# Altium project TIDA_00620.PrjPcb (part 8 of 8)

## Sheet Sensörler.SchDoc
size A4; SheetNumber: 5; SheetTotal: 5
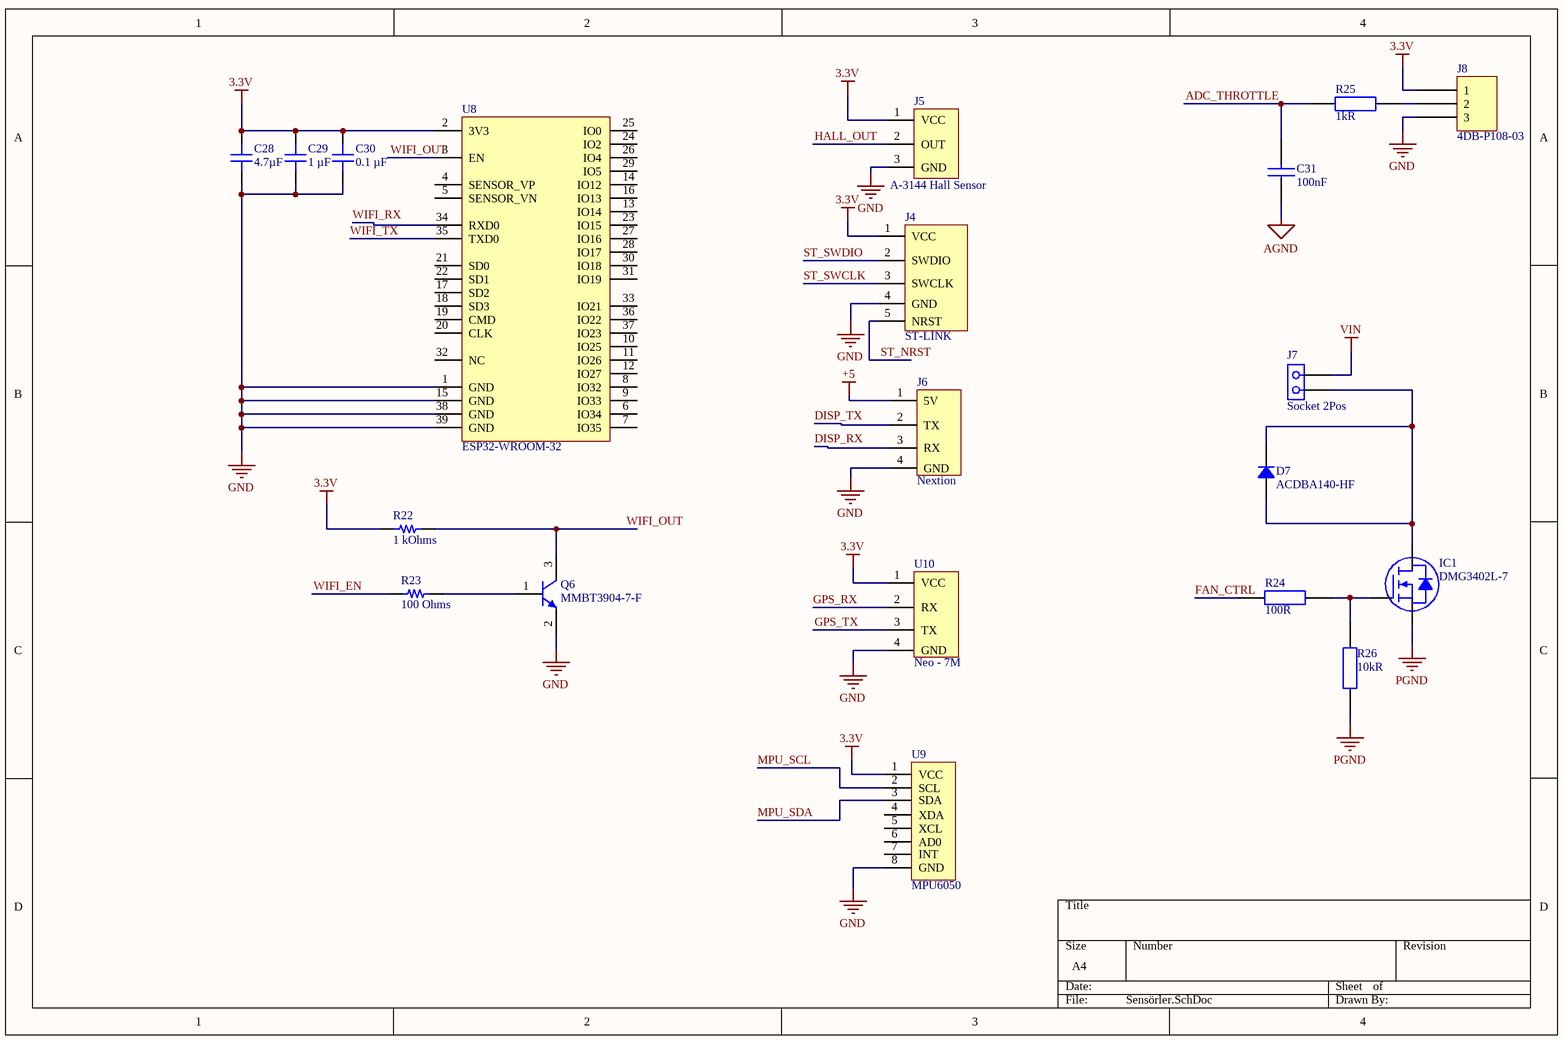
[diagram p4: Sensörler.SchDoc]

### Parts
C28  4.7µF  [CAP 0805_2012]
C29  1 µF  [CAP 0805_2012]
C30  0.1 µF  [CAP 0805_2012]
C31  Capacitance: 100nF  [CAP_0805]  (hidden comment: CL21B104KBCNNNC)
D7  ACDBA140-HF  [DO214AC SMA]
IC1  DMG3402L-7  [DIODES SOT-23-3]
J4  ST-LİNK  [ST-LİNK]
J5  A-3144 Hall Sensor  [A-3144]
J6  Nextion  [Nextion]
J7  Socket 2Pos  [691101710002]
J8  4DB-P108-03  [TE 4DB-P108-03]
Q6  MMBT3904-7-F  [DIODES SOT-23-3]
R22  1 kOhms  [RES 0603_1608]
R23  100 Ohms  [RES 0402_1005]
R24  Resistance: 100R  [RES_0603]  (hidden comment: RC0603JR-07100RL)
R25  Resistance: 1kR  [RES_0603]  (hidden comment: RC0603FR-0710KL)
R26  Resistance: 10kR  [RES_0603]  (hidden comment: RC0603FR-0710KL)
U8  ESP32-WROOM-32  [ESP32-32]
U9  MPU6050  [MPU6050]
U10  Neo - 7M  [Neo - 7M]

### Nets
3.3V: C28.2 C29.2 C30.2 J4.1(VCC) J5.1(VCC) J8.1 R22.1 U8.2(3V3) U9.1(VCC) U10.1(VCC)
+5: J6.1(5V)
AGND: C31.1
GND: C28.1 C29.1 C30.1 J4.4(GND) J5.3(GND) J6.4(GND) J8.3 Q6.2(E) U8.1(GND) U8.15(GND) U8.38(GND) U8.39(GND) U9.8(GND) U10.4(GND)
PGND: IC1.2(S) R26.1
VIN: J7.2
ADC_THROTTLE: C31.2 R25.1
DISP_RX: J6.3(RX)
DISP_TX: J6.2(TX)
FAN_CTRL: R24.1
GPS_RX: U10.2(RX)
GPS_TX: U10.3(TX)
HALL_OUT: J5.2(OUT)
MPU_SCL: U9.2(SCL)
MPU_SDA: U9.3(SDA)
ST_NRST: J4.5(NRST)  [project net NRST]
ST_SWCLK: J4.3(SWCLK)
ST_SWDIO: J4.2(SWDIO)
WIFI_EN: R23.1
WIFI_OUT: Q6.3(C) R22.2 U8.3(EN)
WIFI_RX: U8.34(RXD0)
WIFI_TX: U8.35(TXD0)
NetD7_1: D7.1 D7.2 IC1.3(D) J7.1
NetIC1_1: IC1.1(G) R24.2 R26.2
NetJ8_2: J8.2 R25.2
NetQ6_1: Q6.1(B) R23.2

Not connected (* = marked no-connect by the designer): U8 4(SENSOR_VP) 5(SENSOR_VN) 6(IO34) 7(IO35) 8(IO32) 9(IO33) 10(IO25) 11(IO26) 12(IO27) 13(IO14) 14(IO12) 16(IO13) 17(SD2) 18(SD3) 19(CMD) 20(CLK) 21(SD0) 22(SD1) 23(IO15) 24(IO2) 25(IO0) 26(IO4) 27(IO16) 28(IO17) 29(IO5) 30(IO18) 31(IO19) 32(NC) 33(IO21) 36(IO22) 37(IO23); U9 4(XDA) 5(XCL) 6(AD0) 7(INT)

### Library data of the parts
C28 = 0805YD475MAT2A: CAP CER 4.7UF 16V X5R 0805; manufacturer: AVX Corporation; Tolerance: ±20%; Part Number: 0805YD475MAT2A; Capacitance: 4.7µF; Applications: General Purpose; componentlink1description: Datasheet; componentlink1url: http://datasheets.avx.com/cx5r.pdf; componentlink2description: DigiKey Link; componentlink2url: http://digikey.com/product-detail/en/avx-corporation/0805YD475MAT2A/478-6223-1-ND/2391422; Device Package: 0805 (2012 Metric); lastupdated: 2.09.2020 01:04:29; Lifecycle Status: Active; Minimum Order: 1; Mounting Type: Surface Mount, MLCC; Operating Temperature: -55°C ~ 85°C; Package / Case: 0805 (2012 Metric); packaging: TapeAndReel; partid: 9663; Part Status: Active; price: 0.19; series: -; Size / Dimension: 0.079" L x 0.049" W (2.01mm x 1.25mm); Supplier 1: DigiKey; Supplier Part Number 1: 478-6223-1-ND; Temperature Coefficient: X5R; Thickness (Max): 0.055" (1.40mm); value: 4.7µF; Voltage - Rated: 16V
C29 = EMK212B7105KGHTR: CAP CER 1UF 16V X7R 0805; manufacturer: Taiyo Yuden; Tolerance: ±10%; Part Number: EMK212B7105KGHTR; Capacitance: 1 µF; Applications: Automotive; componentlink1description: Datasheet; componentlink1url: https://ds.yuden.co.jp/TYCOMPAS/ut/detail?pn=EMK212B7105KGHTR &u=M; componentlink2description: DigiKey Link; componentlink2url: https://www.digikey.com/en/products/detail/taiyo-yuden/EMK212B7105KGHTR/6563155; Device Package: 0805 (2012 Metric); lastupdated: 9.02.2024 20:16:06; Lifecycle Status: Active; Minimum Order: 1; Mounting Type: Surface Mount, MLCC; Operating Temperature: -55°C ~ 125°C; Package / Case: 0805 (2012 Metric); packaging: TapeAndReel; partid: 3641; Part Status: Active; price: 0.03; Ratings: AEC-Q200; series: M; Size / Dimension: 0.079" L x 0.049" W (2.00mm x 1.25mm); Supplier 1: DigiKey; Supplier Part Number 1: 587-6310-1-ND; Temperature Coefficient: X7R; Thickness (Max): 0.053" (1.35mm); value: 1 µF; Voltage - Rated: 16V
C30 = 0805B104K160CT: CAP CER 0.1UF 16V X7R 0805; manufacturer: Walsin Technology Corporation; Tolerance: ±10%; Part Number: 0805B104K160CT; Capacitance: 0.1 µF; Applications: General Purpose; componentlink1description: Datasheet; componentlink1url: http://www.passivecomponent.com/wp-content/uploads/2018/10/MLCC.pdf; componentlink2description: DigiKey Link; componentlink2url: https://www.digikey.com/en/products/detail/walsin-technology-corporation/0805B104K160CT/9355062; Device Package: 0805 (2012 Metric); lastupdated: 9.02.2024 20:16:02; Lifecycle Status: Active; Minimum Order: 1; Mounting Type: Surface Mount, MLCC; Operating Temperature: -55°C ~ 125°C; Package / Case: 0805 (2012 Metric); packaging: TapeAndReel; partid: 4882; Part Status: Active; price: 0.01; series: -; Size / Dimension: 0.079" L x 0.049" W (2.00mm x 1.25mm); Supplier 1: DigiKey; Supplier Part Number 1: 1292-1565-1-ND; Temperature Coefficient: X7R; Thickness (Max): 0.035" (0.90mm); value: 0.1 µF; Voltage - Rated: 16V
C31 = CAP CER 100nF 0805: CAP CER 100nF %10 0805; Manufacturer: Samsung; Designed by: BERK; Material: Ceramic; Tolerance: 10%; Dielectric: X7R; Voltage Rating: 50V; Supplier 1: Digi-Key; Manufacturer Part Number: CL21B104KBCNNNC; RoHS: Yes; Category: Ceramic Capacitors; Stock 1: 3371502; Pricing 1: 1=0,10000, 10=0,04700, 50=0,02560, 100=0,02090, 500=0,01494, 1000=0,01174 (USD); Mount: Surface Mount; Case/Package: 0805; Case Code (Metric): 2012; Case Code (Imperial): 0805; Contact Plating: Tin; Min Operating Temperature: -55°C; Max Operating Temperature: 125°C; Packaging: Tape and Reel; Voltage: 50V; Voltage Rating (DC): 50V; Series: CL; Construction: Flat; Length: 2mm; Width: 0.049inch; Height: 0.85mm; Depth: 1.25mm; Thickness: 0.037inch; Radiation Hardening: No; Lead Free: Lead Free; RoHS Compliant: Yes; ComponentLink1URL: https://datasheet.ciiva.com/25710/cl21b104kbcnnnc-25710182.pdf?src-supplier=Digi-Key; ComponentLink1Description: https://datasheet.ciiva.com/25710/cl21b104kbcnnnc-25710182.pdf?src-supplier=Digi-Key; ComponentLink2URL: https://datasheet.ciiva.com/29199/454152-da-01-en-vs-kondensator-0805-29199814.pdf?src-supplier=Conrad; ComponentLink2Description: https://datasheet.ciiva.com/29199/454152-da-01-en-vs-kondensator-0805-29199814.pdf?src-supplier=Conrad; Supplier Part Number 1: 1276-1003-1-ND
D7 = ACDBA140-HF: DIODE SCHOTTKY 40V 1A DO214AC; Manufacturer: Comchip Technology; Capacitance @ Vr, F: 65pF @ 4V, 1MHz; Current - Reverse Leakage @ Vr: 500 µA @ 40 V; Speed: Fast Recovery =< 500ns, > 200mA (Io); Voltage - Forward (Vf) (Max) @ If: 500 mV @ 1 A; Part Number: ACDBA140-HF; ComponentLink1Description: Datasheet; ComponentLink1URL: http://www.comchiptech.com/admin/files/product/ACDBA140-HF%20RevA666308.pdf; ComponentLink2Description: DigiKey Link; ComponentLink2URL: https://www.digikey.com/en/products/detail/comchip-technology/ACDBA140-HF/7100722; Current - Average Rectified (Io): 1A; Diode Type: Schottky; LastUpdated: 3.06.2024 19:54:32; Lifecycle Status: Active; Minimum Order: 1; Mounting Type: Surface Mount; Operating Temperature - Junction: -55°C ~ 125°C; Package / Case: DO-214AC, SMA; Packaging: TapeAndReel; PartId: 2046; Part Status: Active; Price: 0.07; Series: Automotive, AEC-Q101; Supplier 1: DigiKey; Supplier Part Number 1: 641-1872-1-ND; Supplier Device Package: DO-214AC (SMA); Voltage - DC Reverse (Vr) (Max): 40 V
IC1 = DMG3402L-7: MOSFET N-CH 30V 4A SOT23; Manufacturer: Diodes Incorporated; Current - Continuous Drain (Id) @ 25°C: 4A (Ta); Drive Voltage (Max Rds On,  Min Rds On): 2.5V, 10V; FET Type: N-Channel; Gate Charge (Qg) (Max) @ Vgs: 11.7 nC @ 10 V; Input Capacitance (Ciss) (Max) @ Vds: 464 pF @ 15 V; Power Dissipation (Max): 1.4W (Ta); Rds On (Max) @ Id, Vgs: 52mOhm @ 4A, 10V; Vgs (Max): ±12V; Vgs(th) (Max) @ Id: 1.4V @ 250µA; Part Number: DMG3402L-7; ComponentLink1Description: Datasheet; ComponentLink1URL: https://www.diodes.com/assets/Datasheets/DMG3402L.pdf; ComponentLink2Description: DigiKey Link; ComponentLink2URL: https://www.digikey.com/en/products/detail/diodes-incorporated/DMG3402L-7/4747630; Drain to Source Voltage (Vdss): 30 V; LastUpdated: 3.06.2024 20:15:16; Lifecycle Status: Active; Minimum Order: 1; Mounting Type: Surface Mount; Operating Temperature: -55°C ~ 150°C (TJ); Package / Case: TO-236-3, SC-59, SOT-23-3; Packaging: TapeAndReel; Part Status: Active; Price: 0.05; Series: -; Supplier 1: DigiKey; Supplier Part Number 1: DMG3402L-7DICT-ND; Supplier Device Package: SOT-23-3; Technology: MOSFET (Metal Oxide)
J7 = 691 101 710 002: Conn Terminal Block 2 POS 5mm Solder ST Thru-Hole 16A Box; Manufacturer: Wurth Elektronik; Number of Contacts: 2; Number of Levels: 1; Plating: Steel; Stripping Length: -7mm; Voltage: 250V; Wire/Cable Gauge: 26AWG; Wire Gauge (Min): 14AWG; Supplier: Mouser; Supplier Part Number: 710-691101710002; Manufacturer Part Number: 691101710002; RoHS: Compliant; Category: Terminal Blocks; Stock: 2054; Pricing: 1=0,73, 10=0,657, 50=0,653, 100=0,653, 1000=0,653, 10000=0,653 (USD); Color: Blue; Contact Material: Brass; Contact Plating: Tin; Current: 16A; Current Rating: 16A; Height: 12.6mm; Housing Material: Nylon; Lead Pitch: 5mm; Length: 10mm; Max Operating Temperature: 105°C; Min Operating Temperature: -40°C; Mounting Technology: Through Hole; Pins: 2; Number of Positions Per Level: 2; Number of Rows: 1; Packaging: Box; Pitch: 5mm; Termination: Screw; Voltage Rating: 250V; Width: 11.2mm; Wire Gauge (Max): 26AWG; ComponentLink1URL: https://datasheet.octopart.com:443/691101710002-W%C3%BCrth-Elektronik-datasheet-117282612.pdf?src-supplier=Farnell; ComponentLink1Description: https://datasheet.octopart.com:443/691101710002-W%C3%BCrth-Elektronik-datasheet-117282612.pdf?src-supplier=Farnell; ComponentLink2URL: https://datasheet.octopart.com:443/691101710002-W%C3%BCrth-Elektronik-Midcom-datasheet-10621893.pdf?src-supplier=Farnell; ComponentLink2Description: https://datasheet.octopart.com:443/691101710002-W%C3%BCrth-Elektronik-Midcom-datasheet-10621893.pdf?src-supplier=Farnell; ComponentLink3URL: https://datasheet.octopart.com:443/691101710002-Wurth-Elektronik-datasheet-181965939.pdf?src-supplier=Wurth+Elektronik; ComponentLink3Description: https://datasheet.octopart.com:443/691101710002-Wurth-Elektronik-datasheet-181965939.pdf?src-supplier=Wurth+Elektronik; ComponentLink4URL: https://datasheet.octopart.com:443/691101710002-W%C3%BCrth-Elektronik-Midcom-datasheet-10468440.pdf?src-supplier=Newark; ComponentLink4Description: https://datasheet.octopart.com:443/691101710002-W%C3%BCrth-Elektronik-Midcom-datasheet-10468440.pdf?src-supplier=Newark; ComponentLink5URL: https://datasheet.octopart.com:443/691101710002-W%C3%BCrth-Elektronik-Midcom-datasheet-5404435.pdf?src-supplier=element14+APAC; ComponentLink5Description: https://datasheet.octopart.com:443/691101710002-W%C3%BCrth-Elektronik-Midcom-datasheet-5404435.pdf?src-supplier=element14+APAC; ComponentLink6URL: https://datasheet.octopart.com:443/691101710002-W%C3%BCrth-Elektronik-datasheet-111088173.pdf?src-supplier=RS+(Formerly+Allied+Electronics); ComponentLink6Description: https://datasheet.octopart.com:443/691101710002-W%C3%BCrth-Elektronik-datasheet-111088173.pdf?src-supplier=RS+(Formerly+Allied+Electronics)
J8 = 4DB-P108-03: CONN BARRIER STRIP 3CIRC 0.325"; Manufacturer: TE Connectivity AMP Connectors; Barrier Type: 2 Wall (Dual); Bottom Termination: PC Pin; Current Rating (Amps): 20A; Number of Circuits: 3; Pitch: 0.325" (8.26mm); Top Termination: Screws with Captive Plate; Voltage Rating: 150V; Wire Gauge: 12-22 AWG; Part Number: 4DB-P108-03; Color: Black; ComponentLink1Description: Datasheet; ComponentLink1URL: https://www.te.com/commerce/DocumentDelivery/DDEController?Action=srchrtrv&DocNm=2-1437667-4&DocType=Customer+Drawing&DocLang=English; ComponentLink2Description: DigiKey Link; ComponentLink2URL: http://digikey.com/product-detail/en/te-connectivity-amp-connectors/4DB-P108-03/A98473-ND/1277424; LastUpdated: 15.01.2020 04:13:53; Lifecycle Status: Active; Minimum Order: 1; Number of Rows: 1; Number of Wire Entries: 3; Packaging: Bulk; Part Status: Active; Price: 1.18; Series: 4DB, Buchanan; Supplier 1: DigiKey; Supplier Part Number 1: A98473-ND; Terminal Block Type: Barrier Block
Q6 = MMBT3904-7-F: TRANS NPN 40V 0.2A SOT23-3; Manufacturer: Diodes Incorporated; Current - Collector Cutoff (Max): 50nA (ICBO); Current - Collector (Ic) (Max): 200 mA; DC Current Gain (hFE) (Min) @ Ic, Vce: 100 @ 10mA, 1V; Frequency - Transition: 300MHz; Power - Max: 300 mW; Vce Saturation (Max) @ Ib, Ic: 300mV @ 5mA, 50mA; Part Number: MMBT3904-7-F; ComponentLink1Description: Datasheet; ComponentLink1URL: https://www.diodes.com/assets/Datasheets/ds30036.pdf; ComponentLink2Description: DigiKey Link; ComponentLink2URL: https://www.digikey.com/en/products/detail/diodes-incorporated/MMBT3904-7-F/814494; LastUpdated: 3.06.2024 20:24:11; Lifecycle Status: Active; Minimum Order: 1; Mounting Type: Surface Mount; Operating Temperature: -55°C ~ 150°C (TJ); Package / Case: TO-236-3, SC-59, SOT-23-3; Packaging: TapeAndReel; PartId: 85; Part Status: Active; Price: 0.01; Series: -; Supplier 1: DigiKey; Supplier Part Number 1: MMBT3904-FDICT-ND; Supplier Device Package: SOT-23-3; Transistor Type: NPN; Voltage - Collector Emitter Breakdown (Max): 40 V
R22 = CPF0603B1K0E: RES SMD 1K OHM 0.1% 1/16W 0603; Manufacturer: TE Connectivity Passive Product; Power (Watts): 0.063W, 1/16W; Temperature Coefficient: ±25ppm/°C; Part Number: CPF0603B1K0E; Value: 1 kOhms; ComponentLink1Description: Datasheet; ComponentLink1URL: https://www.te.com/commerce/DocumentDelivery/DDEController?Action=srchrtrv&DocNm=1773200&DocType=DS&DocLang=English; ComponentLink2Description: DigiKey Link; ComponentLink2URL: https://www.digikey.com/en/products/detail/te-connectivity-passive-product/CPF0603B1K0E/2390473; Composition: Thin Film; Device Package: 0603 (1608 Metric); Height - Seated (Max): 0.022" (0.55mm); LastUpdated: 9.02.2024 20:43:37; Lifecycle Status: Active; Minimum Order: 1; Number of Terminations: 2; Operating Temperature: -55°C ~ 155°C; Package / Case: 0603 (1608 Metric); Packaging: TapeAndReel; PartId: 4877; Part Status: Active; Price: 0.09; Resistance: 1 kOhms; Series: CPF, Neohm; Size / Dimension: 0.061" L x 0.031" W (1.55mm x 0.80mm); Supplier 1: DigiKey; Supplier Part Number 1: A119887CT-ND; Supplier Device Package: 0603; Tolerance: ±0.1%
R23 = MCS0402PD1000DE500: RES 100 OHM 0.5% 1/5W 0402; Manufacturer: Vishay Beyschlag; Power (Watts): 0.2W, 1/5W; Temperature Coefficient: ±25ppm/°C; Part Number: MCS0402PD1000DE500; Value: 100 Ohms; ComponentLink1Description: Datasheet; ComponentLink1URL: http://www.vishay.com/docs/28916/mcxhp.pdf; ComponentLink2Description: DigiKey Link; ComponentLink2URL: http://digikey.com/product-detail/en/vishay-beyschlag/MCS0402PD1000DE500/749-1509-1-ND/7245027; Composition: Thin Film; Device Package: 0402 (1005 Metric); Features: Anti-Sulfur, Automotive AEC-Q200; Height - Seated (Max): 0.015" (0.37mm); LastUpdated: 9.02.2024 20:30:24; Lifecycle Status: Active; Minimum Order: 1; Number of Terminations: 2; Operating Temperature: -55°C ~ 175°C; Package / Case: 0402 (1005 Metric); Packaging: TapeAndReel; PartId: 2456; Part Status: Active; Price: 0.08; Ratings: AEC-Q200; Resistance: 100 Ohms; Series: MCS HP; Size / Dimension: 0.039" L x 0.020" W (1.00mm x 0.50mm); Supplier 1: DigiKey; Supplier Part Number 1: 749-1509-1-ND; Supplier Device Package: 0402; Tolerance: ±0.5%
R24 = RES 100 OHM 0603: RES 100 %5 OHM 0603 SMD; Manufacturer: Yageo; Designed by: BERK; Tolerance: 5%; Temperature Coefficient: 100ppm/°C; Voltage Rating (DC): 50V; Power Rating: 100mW; Supplier 1: Digi-Key; Manufacturer Part Number: RC0603JR-07100RL; RoHS: Yes; Category: Chip SMD Resistors; Stock 1: 4334796; Pricing 1: 1=0,10000, 10=0,01900, 100=0,00770, 1000=0,00344, 2500=0,00298 (USD); Case/Package: 0603; Number of Pins: 2; Contact Plating: Tin,Matte; Case Code (Imperial): 0603; Case Code (Metric): 1608; Size Code: 0603; Min Operating Temperature: -55°C; Max Operating Temperature: 155°C; Resistor Type: Thick Film; Packaging: Tape and Reel; Voltage Rating: 50V; Termination: SMD/SMT; Features: Moisture Resistant; Series: RC; Max Power Dissipation: 100mW; Number of Terminations: 2; Construction: Rectangular; Resistance Tolerance: 5%; Length: 1.6mm; Width: 0.8mm; Depth: 0.8mm; Radiation Hardening: No; REACH SVHC: Unknown; Lead Free: Lead Free; Military Standard: Not; RoHS Compliant: Yes; ComponentLink1URL: https://datasheet.ciiva.com/15189/getdatasheetpartid-325207-15189846.pdf?src-supplier=Verical; ComponentLink1Description: https://datasheet.ciiva.com/15189/getdatasheetpartid-325207-15189846.pdf?src-supplier=Verical; ComponentLink2URL: https://datasheet.ciiva.com/8883/pyu-rc0603-51-rohs-l-4-8883047.pdf?src-supplier=Avnet; ComponentLink2Description: https://datasheet.ciiva.com/8883/pyu-rc0603-51-rohs-l-4-8883047.pdf?src-supplier=Avnet; ComponentLink3URL: https://datasheet.ciiva.com/7746/443971-7746425.pdf?src-supplier=Element14; ComponentLink3Description: https://datasheet.ciiva.com/7746/443971-7746425.pdf?src-supplier=Element14; ComponentLink4URL: https://datasheet.ciiva.com/7746/443971-7746426.pdf?src-supplier=Element14; ComponentLink4Description: https://datasheet.ciiva.com/7746/443971-7746426.pdf?src-supplier=Element14; Supplier Part Number 1: 311-100GRCT-ND
R25 = RES 1K OHM 0603: RES 1K %1 OHM 0603 SMD; Manufacturer: Yageo; Manufacturer Part Number: RC0603JR-071KL; Designed by: BERK; Tolerance: 5%; Temperature Coefficient: 100ppm/°C; Voltage Rating (DC): 50V; Power Rating: 100mW; Body Length: 1.6mm; Supplier 1: Digi-Key; RoHS: Yes; Category: Chip SMD Resistors; Stock 1: 5112056; Pricing 1: 1=0,10000, 10=0,01900, 100=0,00770, 1000=0,00344, 2500=0,00298 (USD); Case/Package: 0603; Number of Pins: 2; Contact Plating: Tin,Matte; Case Code (Imperial): 0603; Case Code (Metric): 1608; Size Code: 0603; Min Operating Temperature: -55°C; Max Operating Temperature: 155°C; Resistor Type: Thick Film; Packaging: Tape and Reel; Package Quantity: 5000; Voltage Rating: 50V; Termination: SMD/SMT; Series: RC; Resistance Tolerance: 5%; Construction: Rectangular; Length: 1.6mm; Width: 0.8mm; Height: 0.45mm; Depth: 0.8mm; Radiation Hardening: No; REACH SVHC: Unknown; Lead Free: Lead Free; Military Standard: Not; RoHS Compliant: Yes; ComponentLink1URL: https://datasheet.ciiva.com/8883/pyu-rc0603-51-rohs-l-4-8883051.pdf?src-supplier=Avnet; ComponentLink1Description: https://datasheet.ciiva.com/8883/pyu-rc0603-51-rohs-l-4-8883051.pdf?src-supplier=Avnet; ComponentLink2URL: https://datasheet.ciiva.com/7746/443971-7746461.pdf?src-supplier=Element14; ComponentLink2Description: https://datasheet.ciiva.com/7746/443971-7746461.pdf?src-supplier=Element14; ComponentLink3URL: https://datasheet.ciiva.com/22747/443971-22747533.pdf?src-supplier=Element14; ComponentLink3Description: https://datasheet.ciiva.com/22747/443971-22747533.pdf?src-supplier=Element14; ComponentLink4URL: https://datasheet.ciiva.com/7746/443971-7746462.pdf?src-supplier=Element14; ComponentLink4Description: https://datasheet.ciiva.com/7746/443971-7746462.pdf?src-supplier=Element14; Supplier Part Number 1: 311-1.0KGRCT-ND
R26 = RES 10K OHM 0603: RES 10K %1 OHM 0603 SMD; Manufacturer: Yageo; Designed by: BERK; Tolerance: 1%; Temperature Coefficient: 100ppm/°C; Voltage Rating (DC): 50V; Power Rating: 100mW; Voltage Rating: 75V; Supplier 1: Digi-Key; Manufacturer Part Number: RC0603FR-0710KL; RoHS: Yes; Category: Chip SMD Resistors; Stock 1: 24140601; Pricing 1: 1=0,10000, 10=0,02300, 100=0,00930, 1000=0,00417, 2500=0,00362 (USD); Case/Package: 0603; Number of Pins: 2; Case Code (Imperial): 0603; Case Code (Metric): 1608; Weight: 7.1E-05oz; Size Code: 0603; Min Operating Temperature: -55°C; Max Operating Temperature: 155°C; Resistor Type: Thick Film; Packaging: Tape and Reel; Termination: SMD/SMT; Features: Moisture Resistant; Series: RC; Max Power Dissipation: 100mW; Number of Terminations: 2; Resistance Tolerance: 1%; Construction: Rectangular; Length: 1.6mm; Width: 0.8mm; Height: 0.45mm; Depth: 0.8mm; Lead Pitch: 0.3mm; REACH SVHC: Unknown; Lead Free: Lead Free; Military Standard: Not; RoHS Compliant: Yes; ComponentLink1URL: https://datasheet.ciiva.com/7660/38590-7660789.pdf?src-supplier=Element14; ComponentLink1Description: https://datasheet.ciiva.com/7660/38590-7660789.pdf?src-supplier=Element14; ComponentLink2URL: https://datasheet.ciiva.com/15189/getdatasheetpartid-409289-15189591.pdf?src-supplier=Verical; ComponentLink2Description: https://datasheet.ciiva.com/15189/getdatasheetpartid-409289-15189591.pdf?src-supplier=Verical; ComponentLink3URL: https://datasheet.ciiva.com/46440/1868787-46440891.pdf?src-supplier=Element14; ComponentLink3Description: https://datasheet.ciiva.com/46440/1868787-46440891.pdf?src-supplier=Element14; ComponentLink4URL: https://datasheet.ciiva.com/7983/443971-7983596.pdf?src-supplier=Element14; ComponentLink4Description: https://datasheet.ciiva.com/7983/443971-7983596.pdf?src-supplier=Element14; ComponentLink5URL: https://datasheet.ciiva.com/7746/1738695-7746239.pdf?src-supplier=Element14; ComponentLink5Description: https://datasheet.ciiva.com/7746/1738695-7746239.pdf?src-supplier=Element14; ComponentLink6URL: https://datasheet.ciiva.com/22747/443971-22747519.pdf?src-supplier=Element14; ComponentLink6Description: https://datasheet.ciiva.com/22747/443971-22747519.pdf?src-supplier=Element14; Supplier Part Number 1: 311-10.0KHRCT-ND
U9 = MPU6050: IMU (Inertial Measurement Unit), 6-Axis, Accelerometer, Gyroscope; Manufacturer: InvenSense; Interface: I2C; Max Supply Voltage: 3.46V; Min Supply Voltage: 2.375V; Number of Circuits: 1; Operating Supply Voltage: 2.5V; Output Type: Digital; Power Rating: 100mW; Value: 5.6kΩ; Tolerance: 1%; Voltage Rating: 75V; Supplier: Farnell; Supplier Part Number: 1864742; Manufacturer Part Number: MPU-6050; RoHS: Compliant; Category: Inertial Measurement Units (IMUs); Pricing: 1=6,83, 10=5,7, 25=5,35, 50=5,05, 100=4,81, 250=4,63, 500=4,43 (EUR); Case/Package: 0603; Case Code (Imperial): 0603; Case Code (Metric): 1608; Height: 450µm; Height - Seated (Max): 950µm; Length: 4mm; Lifecycle Status: NRND; Max Length: 4.1mm; Max Operating Temperature: 85°C; Max Thickness: 950µm; Max Width: 4.1mm; Min Length: 3.9mm; Min Operating Temperature: -40°C; Min Thickness: 850µm; Min Width: 3.9mm; Mounting Technology: Surface Mount; Pins: 24; Number of Terminals: 24; Packaging: Tape and Reel; Radiation Hardening: No; REACH SVHC: Yes; Terminal Pitch: 500µm; Width: 4mm; ComponentLink1URL: https://datasheet.octopart.com:443/MPU-6050-InvenSense-datasheet-17844634.pdf?src-supplier=Upverter; ComponentLink1Description: https://datasheet.octopart.com:443/MPU-6050-InvenSense-datasheet-17844634.pdf?src-supplier=Upverter; ComponentLink2URL: https://datasheet.octopart.com:443/MPU-6050-InvenSense-datasheet-21631037.pdf?src-supplier=IHS; ComponentLink2Description: https://datasheet.octopart.com:443/MPU-6050-InvenSense-datasheet-21631037.pdf?src-supplier=IHS; ComponentLink3URL: https://datasheet.octopart.com:443/MPU-6050-InvenSense-datasheet-14421344.pdf?src-supplier=element14+APAC; ComponentLink3Description: https://datasheet.octopart.com:443/MPU-6050-InvenSense-datasheet-14421344.pdf?src-supplier=element14+APAC; ComponentLink4URL: https://datasheet.octopart.com:443/MPU-6050-InvenSense-datasheet-8859467.pdf?src-supplier=Newark; ComponentLink4Description: https://datasheet.octopart.com:443/MPU-6050-InvenSense-datasheet-8859467.pdf?src-supplier=Newark; ComponentLink5URL: https://datasheet.octopart.com:443/MPU-6050-InvenSense-datasheet-155375909.pdf?src-supplier=TDK; ComponentLink5Description: https://datasheet.octopart.com:443/MPU-6050-InvenSense-datasheet-155375909.pdf?src-supplier=TDK; ComponentLink6URL: https://datasheet.octopart.com:443/MPU-6050-InvenSense-datasheet-11762955.pdf?src-supplier=Farnell; ComponentLink6Description: https://datasheet.octopart.com:443/MPU-6050-InvenSense-datasheet-11762955.pdf?src-supplier=Farnell

## Nets that join several sheets
3.3V: Güç ve Koruma (7 pins), Motor Driver (6 pins), MCU (13 pins), Sensörler (10 pins)
+5: Güç ve Koruma (6 pins), Sensörler (J6.1)
AGND: Güç ve Koruma (5 pins), Motor Driver (NT6.1 R12.3), Sensörler (C31.1)
GND: Koruma (J1.2 U12.9), Güç ve Koruma (C2.2 C3.2 U2.1 U3.2), Motor Driver (13 pins), MCU (18 pins), Sensörler (14 pins)
PGND: Koruma (5 pins), Güç ve Koruma (7 pins), Motor Driver (10 pins), Sensörler (IC1.2 R26.1)
VIN: Koruma (C34.2 R35.2 RS1.2), Güç ve Koruma (6 pins), Motor Driver (C8.2 C9.2 C10.2 U6.1), Sensörler (J7.2)
VM: Güç ve Koruma (RL1.3), Motor Driver (6 pins)
ADC_THROTTLE: MCU (U7.17), Sensörler (C31.2 R25.1)
CUR_SNS: Motor Driver (C13.2 R8.2), MCU (U7.12)
DISP_RX: MCU (U7.30), Sensörler (J6.3)
DISP_TX: MCU (U7.33), Sensörler (J6.2)
DRV_PWM_1: Motor Driver (U6.15), MCU (U7.42)
DRV_PWM_2: Motor Driver (U6.14), MCU (U7.43)
FAN_CTRL: MCU (U7.57), Sensörler (R24.1)
FAULT_DRV: Motor Driver (D5.1 R9.2 U6.9), MCU (U7.19)
GPS_RX: MCU (U7.52), Sensörler (U10.2)
GPS_TX: MCU (U7.53), Sensörler (U10.3)
HALL_OUT: MCU (U7.8), Sensörler (J5.2)
MPU_SCL: MCU (U7.35), Sensörler (U9.2)
MPU_SDA: MCU (U7.36), Sensörler (U9.3)
NRST: MCU (C19.2 R19.1 S1.1 U7.7), Sensörler (J4.5)
RLY_EN: Güç ve Koruma (R1.1), MCU (U7.20)
SLEEP_DRV: Motor Driver (R13.1 U6.13), MCU (U7.18)
ST_SWCLK: MCU (U7.50), Sensörler (J4.3)
ST_SWDIO: MCU (U7.49), Sensörler (J4.2)
SYS_STATUS: Motor Driver (R7.1), MCU (U7.58)
TEMP_SNS: Güç ve Koruma (U4.3), MCU (U7.14)
VBAT_MON: Güç ve Koruma (D3.3 R2.2 R3.1), MCU (U7.13)
WIFI_EN: MCU (R20.2), Sensörler (R23.1)
WIFI_RX: MCU (U7.59), Sensörler (U8.34)
WIFI_TX: MCU (U7.60), Sensörler (U8.35)